# Altium schematic sheet Power.SchDoc
size B
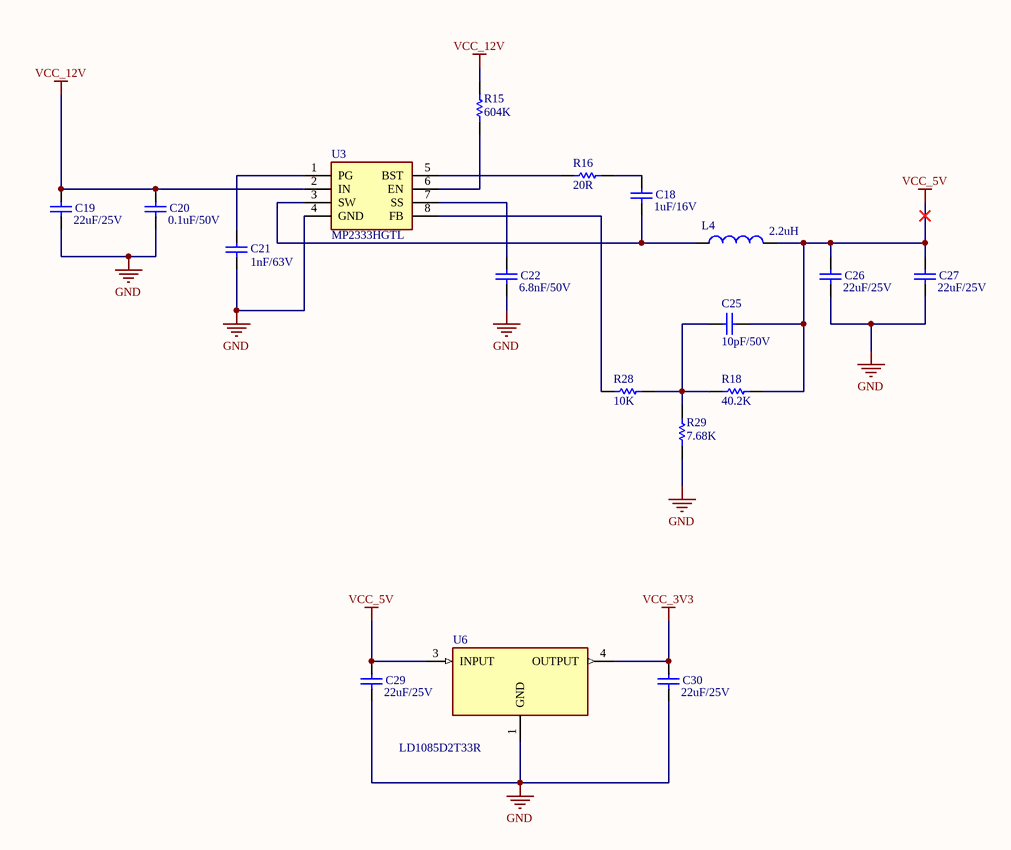
[diagram p0: Power.SchDoc]

## Parts
C18  1uF/16V  [0603C]
C19  22uF/25V  [1210C]
C20  0.1uF/50V  [0603C]
C21  1nF/63V  [0603C]
C22  6.8nF/50V  [0603C]
C25  10pF/50V  [0603C]
C26  22uF/25V  [1210C]
C27  22uF/25V  [1210C]
C29  22uF/25V  [1210C]
C30  22uF/25V  [1210C]
L4  2.2uH  [IHLP1616BZER2R2M5A]
R15  604K  [0603R]
R16  20R  [0603R]
R18  40.2K  [0603R]
R28  10K  [0603R]
R29  7.68K  [0603R]
U3  MP2333HGTL  [MP2333HGTL-P]
U6  LD1085D2T33R  [LD1085D2T33R]

## Nets
GND: C19.1 C20.1 C21.1 C22.1 C26.1 C27.1 C29.1 C30.1 R29.2 U3.4(GND) U6.1(GND)
VCC_3V3: C30.2 U6.4(OUTPUT)
VCC_5V: C25.1 C26.2 C27.2 C29.2 L4.2 R18.2 U6.3(INPUT)
VCC_12V: C19.2 C20.2 R15.2 U3.2(IN)
NetC18_1: C18.1 L4.1 U3.3(SW)
NetC18_2: C18.2 R16.2
NetC21_2: C21.2 U3.1(PG)
NetC22_2: C22.2 U3.7(SS)
NetC25_2: C25.2 R18.1 R28.1 R29.1
NetR15_1: R15.1 U3.6(EN)
NetR16_1: R16.1 U3.5(BST)
NetR28_2: R28.2 U3.8(FB)

## Library data of the parts
C18 = Cap: Multilayer Ceramic Capacitors MLCC - SMD/SMT 16volts 1uF X7R 10%; Mfr: KEMET; Mfr Part No: C0603C105K4RAC7411; Package: 0603; Price: 0.101; Stockiest: MOUSER; Stockiest Part No: 80-C0603C105K4RLR; Value: 1uF/16V
C19 C26 C27 C29 C30 = Cap: Multilayer Ceramic Capacitors MLCC - SMD/SMT 1210 25VDC 22uF 20% X7R AEC-Q200; Mfr: Taiyo Yuden; Mfr Part No: TMK325B7226MMHP; Package: 1210; Price: 0.807; Stockiest: MOUSER; Stockiest Part No: 963-TMK325B7226MMHP; Value: 22uF/25V
C20 = Cap: Multilayer Ceramic Capacitors MLCC - SMD/SMT 50V 0.1uF 0603 X7R 20%; Mfr: KEMET; Mfr Part No: C0603C104M5RACTU; Package: 0603; Price: 0.101; Stockiest: MOUSER; Stockiest Part No: 80-C0603C104M5R; Value: 0.1uF/50V
C21 = Cap: Multilayer Ceramic Capacitors MLCC - SMD/SMT 63V 1000pF 0603 X7R 10% AEC-Q200; Mfr: KEMET; Mfr Part No: 80-C0603C102KMREAUTO; Package: 0603; Price: 0.201; Stockiest: MOUSER; Stockiest Part No: C0603C102KMRECAUTO; Value: 1nF/63V
C22 = Cap: Multilayer Ceramic Capacitors MLCC - SMD/SMT 0603 50VDC 6.8nF 5% C0G AEC-Q200; Mfr: TDK; Mfr Part No: CGA3E2C0G1H682J080AE; Package: 0603; Price: 0.363; Stockiest: MOUSER; Stockiest Part No: 810-CGA3E2C0G1H682J8; Value: 6.8nF/50V
C25 = Cap: Multilayer Ceramic Capacitors MLCC - SMD/SMT 50V 10pF 0603 C0G 5% AEC-Q200; Mfr: KEMET; Mfr Part No: C0603C100J5GACAUTO; Package: 0603; Price: 0.192; Stockiest: MOUSER; Stockiest Part No: 80-C0603C100J5GAUTO; Value: 10pF/50V
L4 = INDUCTOR: Fixed Inductors 2.2uH 20% High Temp AEC-Q200; Mfr: Vishay / Dale; Mfr Part No: IHLP1616BZER2R2M5A; Price: 1.36; Stockiest: MOUSER; Stockiest Part No: 70-IHLP1616BZR2R2M5A; Value: 2.2uH
R15 = Res1: Thick Film Resistors - SMD 0603 1% 604Kohm Anti-Sulfur AEC-Q200; Mfr: Panasonic; Mfr Part No: ERJ-U03F6043V; Package: 0603; Price: 0.221; Stockiest: MOUSER; Stockiest Part No: 667-ERJ-U03F6043V; Value: 604K
R16 = Res1: Thick Film Resistors - SMD 0603 0.25W 1% 20ohm AEC-Q200; Mfr: Panasonic; Mfr Part No: ERJ-UP3F20R0V; Package: 0603; Price: 0.262; Stockiest: MOUSER; Stockiest Part No: 667-ERJ-UP3F20R0V; Value: 20R
R18 = Res1: Thick Film Resistors - SMD 0603 Anti-Surge Res. 0.1%, 40.2Koh; Mfr: Panasonic; Mfr Part No: ERJ-PB3B4022V; Package: 0603; Price: 0.252; Stockiest: MOUSER; Stockiest Part No: 667-ERJ-PB3B4022V; Value: 40.2K
R28 = Res1: Thick Film Resistors - SMD 0603 10Kohms 1% Anti-Sulfur AEC-Q200; Mfr: ROHM Semiconductor; Mfr Part No: SFR03EZPF1002; Package: 0603; Price: 0.101; Stockiest: MOUSER; Stockiest Part No: 755-SFR03EZPF1002; Value: 10K
R29 = Res1: Thick Film Resistors - SMD 0603 Anti-Surge Res. 0.1%, 7.68Koh; Mfr: Panasonic; Mfr Part No: ERJ-PB3B7681V; Package: 0603; Price: 0.252; Stockiest: MOUSER; Stockiest Part No: 667-ERJ-PB3B7681V; Value: 7.68K
U3 = MP2333HGTL: Switching Voltage Regulators High-Efficiency, 3A, 18V, 1200kHz, Synchronous, Step-Down Converter; Mfr: Monolithic Power Systems (MPS); Value: 3.3V; Mfr Part No: MP2333HGTL-P; Price: 1.89; Stockiest: MOUSER; Stockiest Part No: 946-MP2333HGTL-P
U6 = LD1085D2T33R: Integrated Circuit; Mfr: STMicroelectronics; Value: 3.3V; Mfr Part No: LD1085D2T33R; Price: 1.30; Stockiest: MOUSER; Stockiest Part No: 511-LD1085D2T33-TR